# Altium schematic sheet STM32G4_DRV8301_hardware_TOP_V1.0.SchDoc
size 420 x 297 mm; SheetNumber: 2; SheetTotal: 9
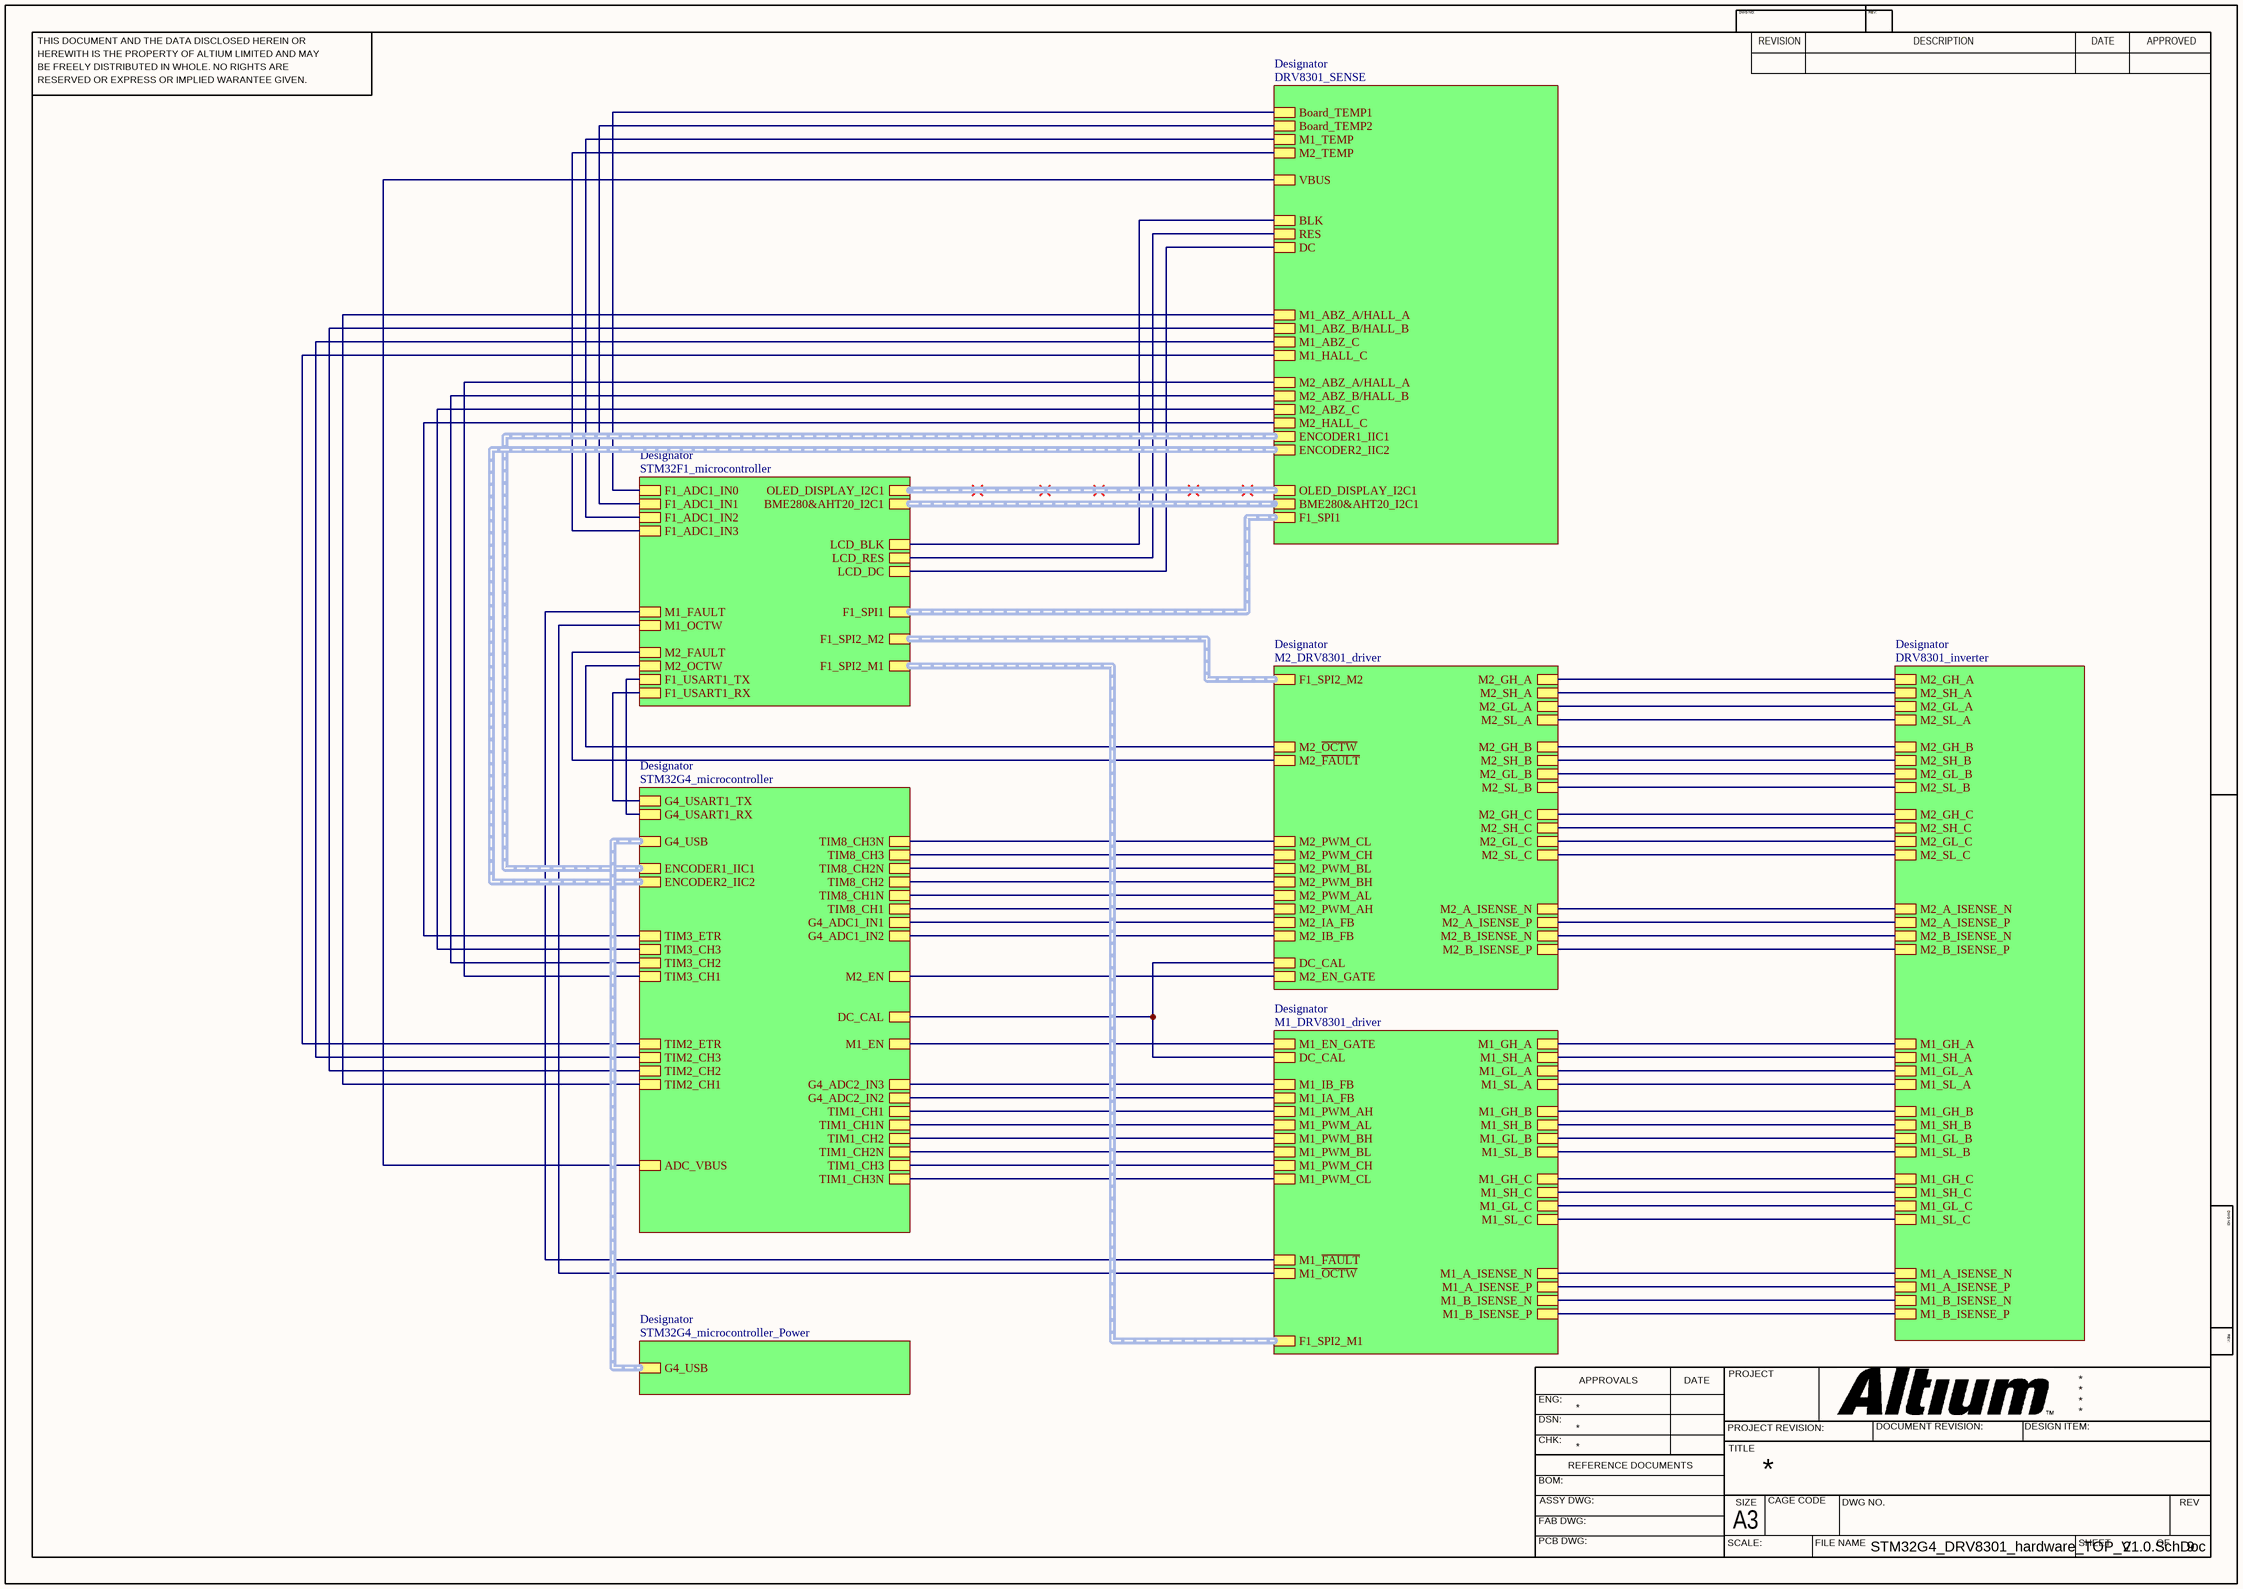
[diagram p0: STM32G4_DRV8301_hardware_TOP_V1.0.SchDoc]

## Sub-sheets
Designator = STM32G4_microcontroller: G4_ADC1_IN1, G4_ADC1_IN2, TIM3_CH2, G4_ADC2_IN3, M2_EN, ADC_VBUS, G4_ADC2_IN2, TIM3_CH1, TIM3_ETR, ENCODER2_IIC2 (harness ENCODER2_IIC2), G4_USB (harness G4_USB), ENCODER1_IIC1 (harness ENCODER1_IIC1), DC_CAL, M1_EN, TIM1_CH1, TIM1_CH2, TIM1_CH3, TIM1_CH1N, TIM1_CH2N, TIM1_CH3N, TIM8_CH1, TIM8_CH2, TIM8_CH3, TIM8_CH1N, TIM8_CH2N, TIM8_CH3N, TIM3_CH3, TIM2_ETR, TIM2_CH1, TIM2_CH2, TIM2_CH3, G4_USART1_TX, G4_USART1_RX
Designator = STM32G4_microcontroller_Power: G4_USB (harness G4_USB)
Designator = M1_DRV8301_driver: M1_PWM_AL, M1_PWM_AH, M1_PWM_BH, M1_PWM_CH, M1_PWM_BL, M1_PWM_CL, M1_~{OCTW}, M1_~{FAULT}, M1_IA_FB, M1_EN_GATE, M1_IB_FB, M1_GH_A, M1_SH_A, M1_GL_A, M1_SL_A, M1_GH_B, M1_SH_B, M1_GL_B, M1_SL_B, M1_GH_C, M1_SH_C, M1_GL_C, M1_SL_C, M1_A_ISENSE_N, M1_A_ISENSE_P, M1_B_ISENSE_N, M1_B_ISENSE_P, DC_CAL, F1_SPI2_M1 (harness F1_SPI2_M1)
Designator = DRV8301_inverter: M2_GH_A, M2_SH_A, M2_GL_A, M2_SL_A, M2_GH_B, M2_SH_B, M2_GL_B, M2_SL_B, M2_GH_C, M2_SH_C, M2_GL_C, M2_SL_C, M2_A_ISENSE_N, M2_A_ISENSE_P, M2_B_ISENSE_N, M2_B_ISENSE_P, M1_GH_A, M1_SH_A, M1_GL_A, M1_SL_A, M1_GH_B, M1_SH_B, M1_GL_B, M1_SL_B, M1_GH_C, M1_SH_C, M1_GL_C, M1_SL_C, M1_A_ISENSE_N, M1_A_ISENSE_P, M1_B_ISENSE_N, M1_B_ISENSE_P
Designator = STM32F1_microcontroller: F1_ADC1_IN0, M2_FAULT, M2_OCTW, M1_FAULT, M1_OCTW, BME280&AHT20_I2C1 (harness BME280&AHT20_I2C1), OLED_DISPLAY_I2C1 (harness OLED_DISPLAY_I2C1), F1_ADC1_IN1, F1_ADC1_IN2, F1_ADC1_IN3, F1_SPI1 (harness F1_SPI1), F1_SPI2_M1 (harness F1_SPI2_M1), F1_SPI2_M2 (harness F1_SPI2_M2), LCD_BLK, LCD_RES, LCD_DC, F1_USART1_TX, F1_USART1_RX
Designator = DRV8301_SENSE: Board_TEMP1, Board_TEMP2, M1_TEMP, M2_TEMP, BLK, DC, RES, OLED_DISPLAY_I2C1 (harness OLED_DISPLAY_I2C1), BME280&AHT20_I2C1 (harness BME280&AHT20_I2C1), F1_SPI1 (harness F1_SPI1), ENCODER2_IIC2 (harness ENCODER2_IIC2), ENCODER1_IIC1 (harness ENCODER1_IIC1), M1_ABZ_A/HALL_A, M1_ABZ_B/HALL_B, M1_HALL_C, M1_ABZ_C, M2_ABZ_A/HALL_A, M2_ABZ_B/HALL_B, M2_HALL_C, M2_ABZ_C, VBUS
Designator = M2_DRV8301_driver: M2_PWM_AL, M2_PWM_AH, M2_PWM_BH, M2_PWM_CH, M2_PWM_BL, M2_PWM_CL, M2_~{OCTW}, M2_~{FAULT}, M2_IA_FB, M2_EN_GATE, M2_IB_FB, M2_GH_A, M2_SH_A, M2_GL_A, M2_SL_A, M2_GH_B, M2_SH_B, M2_GL_B, M2_SL_B, M2_GH_C, M2_SH_C, M2_GL_C, M2_SL_C, M2_A_ISENSE_N, M2_A_ISENSE_P, M2_B_ISENSE_N, M2_B_ISENSE_P, DC_CAL, F1_SPI2_M2 (harness F1_SPI2_M2)

## Nets
(unnamed): sheet Designator/G4_ADC1_IN1, sheet Designator/M2_IA_FB
(unnamed): sheet Designator/G4_ADC1_IN2, sheet Designator/M2_IB_FB
(unnamed): sheet Designator/TIM3_CH2, sheet Designator/M2_ABZ_B/HALL_B
(unnamed): sheet Designator/G4_ADC2_IN3, sheet Designator/M1_IB_FB
(unnamed): sheet Designator/M2_EN, sheet Designator/M2_EN_GATE
(unnamed): sheet Designator/ADC_VBUS, sheet Designator/VBUS
(unnamed): sheet Designator/G4_ADC2_IN2, sheet Designator/M1_IA_FB
(unnamed): sheet Designator/TIM3_CH1, sheet Designator/M2_ABZ_A/HALL_A
(unnamed): sheet Designator/TIM3_ETR, sheet Designator/M2_HALL_C
(unnamed): sheet Designator/DC_CAL, sheet Designator/DC_CAL, sheet Designator/DC_CAL
(unnamed): sheet Designator/M1_EN, sheet Designator/M1_EN_GATE
(unnamed): sheet Designator/TIM1_CH1, sheet Designator/M1_PWM_AH
(unnamed): sheet Designator/TIM1_CH2, sheet Designator/M1_PWM_BH
(unnamed): sheet Designator/TIM1_CH3, sheet Designator/M1_PWM_CH
(unnamed): sheet Designator/TIM1_CH1N, sheet Designator/M1_PWM_AL
(unnamed): sheet Designator/TIM1_CH2N, sheet Designator/M1_PWM_BL
(unnamed): sheet Designator/TIM1_CH3N, sheet Designator/M1_PWM_CL
(unnamed): sheet Designator/TIM8_CH1, sheet Designator/M2_PWM_AH
(unnamed): sheet Designator/TIM8_CH2, sheet Designator/M2_PWM_BH
(unnamed): sheet Designator/TIM8_CH3, sheet Designator/M2_PWM_CH
(unnamed): sheet Designator/TIM8_CH1N, sheet Designator/M2_PWM_AL
(unnamed): sheet Designator/TIM8_CH2N, sheet Designator/M2_PWM_BL
(unnamed): sheet Designator/TIM8_CH3N, sheet Designator/M2_PWM_CL
(unnamed): sheet Designator/TIM3_CH3, sheet Designator/M2_ABZ_C
(unnamed): sheet Designator/TIM2_ETR, sheet Designator/M1_HALL_C
(unnamed): sheet Designator/TIM2_CH1, sheet Designator/M1_ABZ_A/HALL_A
(unnamed): sheet Designator/TIM2_CH2, sheet Designator/M1_ABZ_B/HALL_B
(unnamed): sheet Designator/TIM2_CH3, sheet Designator/M1_ABZ_C
(unnamed): sheet Designator/G4_USART1_TX, sheet Designator/F1_USART1_RX
(unnamed): sheet Designator/G4_USART1_RX, sheet Designator/F1_USART1_TX
(unnamed): sheet Designator/M1_~{OCTW}, sheet Designator/M1_OCTW
(unnamed): sheet Designator/M1_~{FAULT}, sheet Designator/M1_FAULT
(unnamed): sheet Designator/M1_GH_A, sheet Designator/M1_GH_A
(unnamed): sheet Designator/M1_SH_A, sheet Designator/M1_SH_A
(unnamed): sheet Designator/M1_GL_A, sheet Designator/M1_GL_A
(unnamed): sheet Designator/M1_SL_A, sheet Designator/M1_SL_A
(unnamed): sheet Designator/M1_GH_B, sheet Designator/M1_GH_B
(unnamed): sheet Designator/M1_SH_B, sheet Designator/M1_SH_B
(unnamed): sheet Designator/M1_GL_B, sheet Designator/M1_GL_B
(unnamed): sheet Designator/M1_SL_B, sheet Designator/M1_SL_B
(unnamed): sheet Designator/M1_GH_C, sheet Designator/M1_GH_C
(unnamed): sheet Designator/M1_SH_C, sheet Designator/M1_SH_C
(unnamed): sheet Designator/M1_GL_C, sheet Designator/M1_GL_C
(unnamed): sheet Designator/M1_SL_C, sheet Designator/M1_SL_C
(unnamed): sheet Designator/M1_A_ISENSE_N, sheet Designator/M1_A_ISENSE_N
(unnamed): sheet Designator/M1_A_ISENSE_P, sheet Designator/M1_A_ISENSE_P
(unnamed): sheet Designator/M1_B_ISENSE_N, sheet Designator/M1_B_ISENSE_N
(unnamed): sheet Designator/M1_B_ISENSE_P, sheet Designator/M1_B_ISENSE_P
(unnamed): sheet Designator/M2_GH_A, sheet Designator/M2_GH_A
(unnamed): sheet Designator/M2_SH_A, sheet Designator/M2_SH_A
(unnamed): sheet Designator/M2_GL_A, sheet Designator/M2_GL_A
(unnamed): sheet Designator/M2_SL_A, sheet Designator/M2_SL_A
(unnamed): sheet Designator/M2_GH_B, sheet Designator/M2_GH_B
(unnamed): sheet Designator/M2_SH_B, sheet Designator/M2_SH_B
(unnamed): sheet Designator/M2_GL_B, sheet Designator/M2_GL_B
(unnamed): sheet Designator/M2_SL_B, sheet Designator/M2_SL_B
(unnamed): sheet Designator/M2_GH_C, sheet Designator/M2_GH_C
(unnamed): sheet Designator/M2_SH_C, sheet Designator/M2_SH_C
(unnamed): sheet Designator/M2_GL_C, sheet Designator/M2_GL_C
(unnamed): sheet Designator/M2_SL_C, sheet Designator/M2_SL_C
(unnamed): sheet Designator/M2_A_ISENSE_N, sheet Designator/M2_A_ISENSE_N
(unnamed): sheet Designator/M2_A_ISENSE_P, sheet Designator/M2_A_ISENSE_P
(unnamed): sheet Designator/M2_B_ISENSE_N, sheet Designator/M2_B_ISENSE_N
(unnamed): sheet Designator/M2_B_ISENSE_P, sheet Designator/M2_B_ISENSE_P
(unnamed): sheet Designator/F1_ADC1_IN0, sheet Designator/Board_TEMP1
(unnamed): sheet Designator/M2_FAULT, sheet Designator/M2_~{FAULT}
(unnamed): sheet Designator/M2_OCTW, sheet Designator/M2_~{OCTW}
(unnamed): sheet Designator/F1_ADC1_IN1, sheet Designator/Board_TEMP2
(unnamed): sheet Designator/F1_ADC1_IN2, sheet Designator/M1_TEMP
(unnamed): sheet Designator/F1_ADC1_IN3, sheet Designator/M2_TEMP
(unnamed): sheet Designator/LCD_BLK, sheet Designator/BLK
(unnamed): sheet Designator/LCD_RES, sheet Designator/RES
(unnamed): sheet Designator/LCD_DC, sheet Designator/DC

## Notes on the sheet
- THIS DOCUMENT AND THE DATA DISCLOSED HEREIN OR
- HEREWITH IS THE PROPERTY OF ALTIUM LIMITED AND MAY
- DWG NO:
- REVISION
- REV:
- DESCRIPTION
- DATE
- APPROVED
- BE FREELY DISTRIBUTED IN WHOLE. NO RIGHTS ARE
- RESERVED OR EXPRESS OR IMPLIED WARANTEE GIVEN.
- ENG:
- APPROVALS
- PROJECT
- DSN:
- CHK:
- REFERENCE DOCUMENTS
- PROJECT REVISION:
- TITLE
- DOCUMENT REVISION:
- DESIGN ITEM:
- BOM:
- FAB DWG:
- PCB DWG:
- ASSY DWG:
- SCALE:
- A3
- SIZE
- CAGE CODE
- FILE NAME
- DWG NO.
- SHEET
- OF
- REV